# Altium project BA-77GHz-Radar_Frontend.PrjPcb (part 2 of 2)

## Sheet PLL_ADF4169.SchDoc
size A3; SheetNumber: 13; SheetTotal: 25
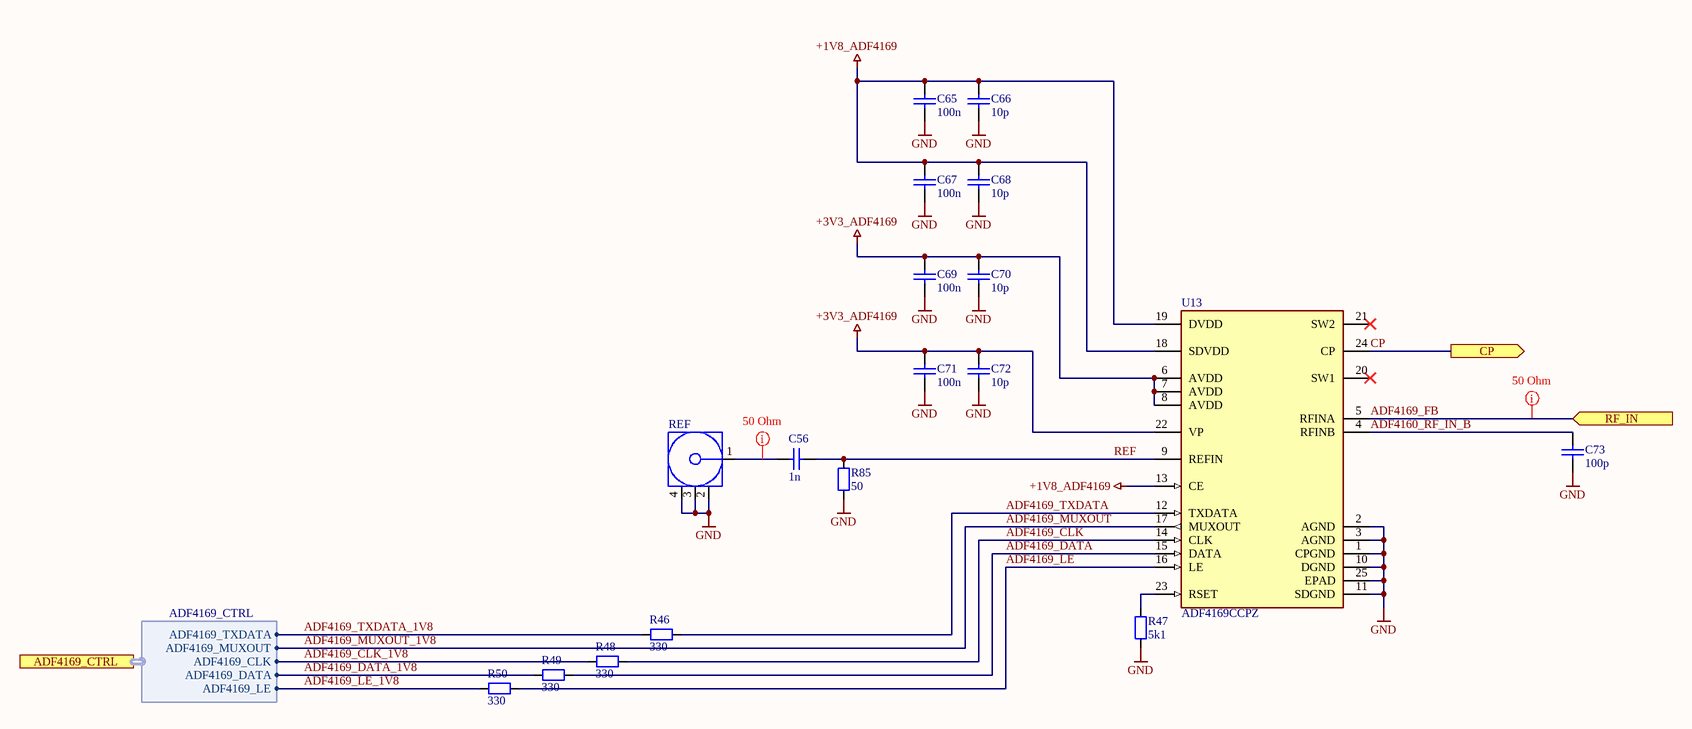
[diagram p13: PLL_ADF4169.SchDoc]

### Parts
C56  1n  [C_0402_1005Metric_IPC_N]
C65  100n  [C_0402_1005Metric_IPC_N]
C66  10p  [C_0402_1005Metric_IPC_N]
C67  100n  [C_0402_1005Metric_IPC_N]
C68  10p  [C_0402_1005Metric_IPC_N]
C69  100n  [C_0402_1005Metric_IPC_N]
C70  10p  [C_0402_1005Metric_IPC_N]
C71  100n  [C_0402_1005Metric_IPC_N]
C72  10p  [C_0402_1005Metric_IPC_N]
C73  100p  [C_0402_1005Metric_IPC_N]
R46  330  [R_0402_1005Metric_IPC_N]
R47  5k1  [R_0402_1005Metric_IPC_N]
R48  330  [R_0402_1005Metric_IPC_N]
R49  330  [R_0402_1005Metric_IPC_N]
R50  330  [R_0402_1005Metric_IPC_N]
R85  50  [R_0402_1005Metric_IPC_N]
REF  60312862112552  [60312862112552]  (value not drawn)
U13  ADF4169CCPZ  [LFCSP-WQ-24-1EP_4x4mm_P0.5mm_EP2.1x2.1mm_IPC_N]

### Ports
ADF4169_CTRL (harness ADF4169_CTRL, see Top_Level[2B], MCU[8A]), CP (out, see Top_Level[2B], Loop_Filter_AD8065[2C]), RF_IN (in, see Top_Level[2B])

### Harnesses
ADF4169_CTRL: ADF4169_MUXOUT, ADF4169_CLK, ADF4169_DATA, ADF4169_LE, ADF4169_TXDATA

### Nets
+1V8_ADF4169: C65.2 C66.2 C67.2 C68.2 U13.13(CE) U13.18(SDVDD) U13.19(DVDD)
+3V3_ADF4169: C69.2 C70.2 C71.2 C72.2 U13.6(AVDD) U13.7(AVDD) U13.8(AVDD) U13.22(VP)
GND: C65.1 C66.1 C67.1 C68.1 C69.1 C70.1 C71.1 C72.1 C73.1 R47.1 R85.1 REF.2(GND) REF.3(GND) REF.4(GND) U13.1(CPGND) U13.2(AGND) U13.3(AGND) U13.10(DGND) U13.11(SDGND) U13.25(EPAD)
ADF4160_RF_IN_B: C73.2 U13.4(RFINB)
ADF4169_CLK: R48.2 U13.14(CLK)
ADF4169_CLK_1V8: R48.1 ; port ADF4169_CTRL.ADF4169_CLK
ADF4169_DATA: R49.2 U13.15(DATA)
ADF4169_DATA_1V8: R49.1 ; port ADF4169_CTRL.ADF4169_DATA  [project net ADF4169_CTRL.ADF4169_DATA]
ADF4169_FB: U13.5(RFINA) ; port RF_IN
ADF4169_LE: R50.2 U13.16(LE)
ADF4169_LE_1V8: R50.1 ; port ADF4169_CTRL.ADF4169_LE  [project net ADF4169_CTRL.ADF4169_LE]
ADF4169_MUXOUT: U13.17(MUXOUT) ; port ADF4169_CTRL.ADF4169_MUXOUT  [also labelled ADF4169_MUXOUT_1V8]  [project net ADF4169_CTRL.ADF4169_MUXOUT]
ADF4169_TXDATA: R46.2 U13.12(TXDATA)
ADF4169_TXDATA_1V8: R46.1 ; port ADF4169_CTRL.ADF4169_TXDATA  [project net ADF4169_CTRL.ADF4169_TXDATA]
CP: U13.24(CP) ; port CP
REF: C56.1 R85.2 U13.9(REFIN)
NetC56_2: C56.2 REF.1(Signal)
NetR47_2: R47.2 U13.23(RSET)

Not connected (* = marked no-connect by the designer): U13 20(SW1)* 21(SW2)*

### Layout directives
net class 50R: ADF4169_FB
net class 50Ohm_CPWG: NetC56_2

### Library data of the parts
C56 = C000002: Generic MLCC with 0402 Footprint; Specific Component: False; Tolerance: 5%; Temp Coefficient: C0G; Voltage Rated: 50V; ID: C000002; Capacitance: 1n; min Temperature: *; max Temperature: *; Case: 0402; Supplier 1: Mouser; Supplier Part Number 1: 81-GRM1555C1H102JA1D; Supplier 2: Digikey; Supplier Part Number 2: 490-3244-1-ND
C65 C67 C69 C71 = C000002: Generic MLCC with 0402 Footprint; Specific Component: False; Tolerance: 10%; Temp Coefficient: X7R; Voltage Rated: 50V; ID: C000002; Capacitance: 100n; min Temperature: *; max Temperature: *; Case: 0402; Supplier 1: Mouser; Supplier Part Number 1: 81-GRM155R71H104KE4D; Supplier 2: Digikey; Supplier Part Number 2: 490-10700-1-ND
C66 C68 C70 C72 = C000002: Generic MLCC with 0402 Footprint; Specific Component: False; Tolerance: 0.5p; Temp Coefficient: C0G; Voltage Rated: 50V; ID: C000002; Capacitance: 10p; min Temperature: *; max Temperature: *; Case: 0402; Supplier 1: Mouser; Supplier Part Number 1: 187-CL05C100DB5NNNC; Supplier 2: Digikey; Supplier Part Number 2: 1276-1625-1-ND
C73 = C000002: as C23 on sheet TPS61377_16V; ID: C000002; Capacitance: 100p; Tolerance: *; Temp Coefficient: *; Voltage Rated: *; min Temperature: *; max Temperature: *; Case: 0402
R46 R48-R50 R85 = R000002: as R12 on sheet TPS61377_16V; ID: R000002; Tolerance: *; Power Rating: *; Composition: *; min Temperature: *; max Temperature: *; Temp Coefficient: *; Case: 0402
  R46 R48-R50: Resistance: 330
  R85: Resistance: 50
R47 = R000002: Generic Chip Resistor with 0402 Footprint; Specific Component: False; Tolerance: 1%; ID: R000002; Resistance: 5k1; Power Rating: *; Composition: *; min Temperature: *; max Temperature: *; Temp Coefficient: *; Case: 0402
REF = X000012: WR-SMA Connector, PCB Solderless, DC~18GHz, 50Ohm; Manufacturer: Würth; Center Contact Diameter: 0.25mm; Connector Type: SMA; Gender: Jack; Interface Type: MIL-STD-348; Manufacturer Part Number: 60312862112552; Category: Coaxial Connectors; Match Code: WR-SMA; ComponentLink1Description: Datasheet; ComponentLink1URL: https://www.we-online.com/components/products/datasheet/60312862112552.pdf; ComponentLink2Description: Datasheet Link; ComponentLink2URL: https://www.we-online.com/redexpert/spec/60312862112552?ad; Mount: Screw; Operating Temperature Max: 165°C; Operating Temperature Min: -65°C; Packaging: Tray; Frequency Range: DC~18GHz; Impedance: 50Ohm; Orientation: Right Angle; ID: X000012; Type: SMA Solderless Würth; Part Value: 60312862112552
U13 = CLK000004: Manufacturer: Analog Devices; ID: CLK000004; Type: PLL; Manufacturer Part Number: ADF4169CCPZ; Part Value: ADF4169CCPZ; Case: 24-LFCSP-WQ (4x4); ComponentLink1Description: Datasheet; ComponentLink1URL: https://www.analog.com/media/en/technical-documentation/data-sheets/ADF4169.pdf; Supplier 1: Mouser; Supplier Part Number 1: 584-ADF4169CCPZ; Supplier 2: Digikey; Supplier Part Number 2: 505-ADF4169CCPZ-ND

## Sheet Prescaler_HMC862A.SchDoc
size A4; SheetNumber: 17; SheetTotal: 26
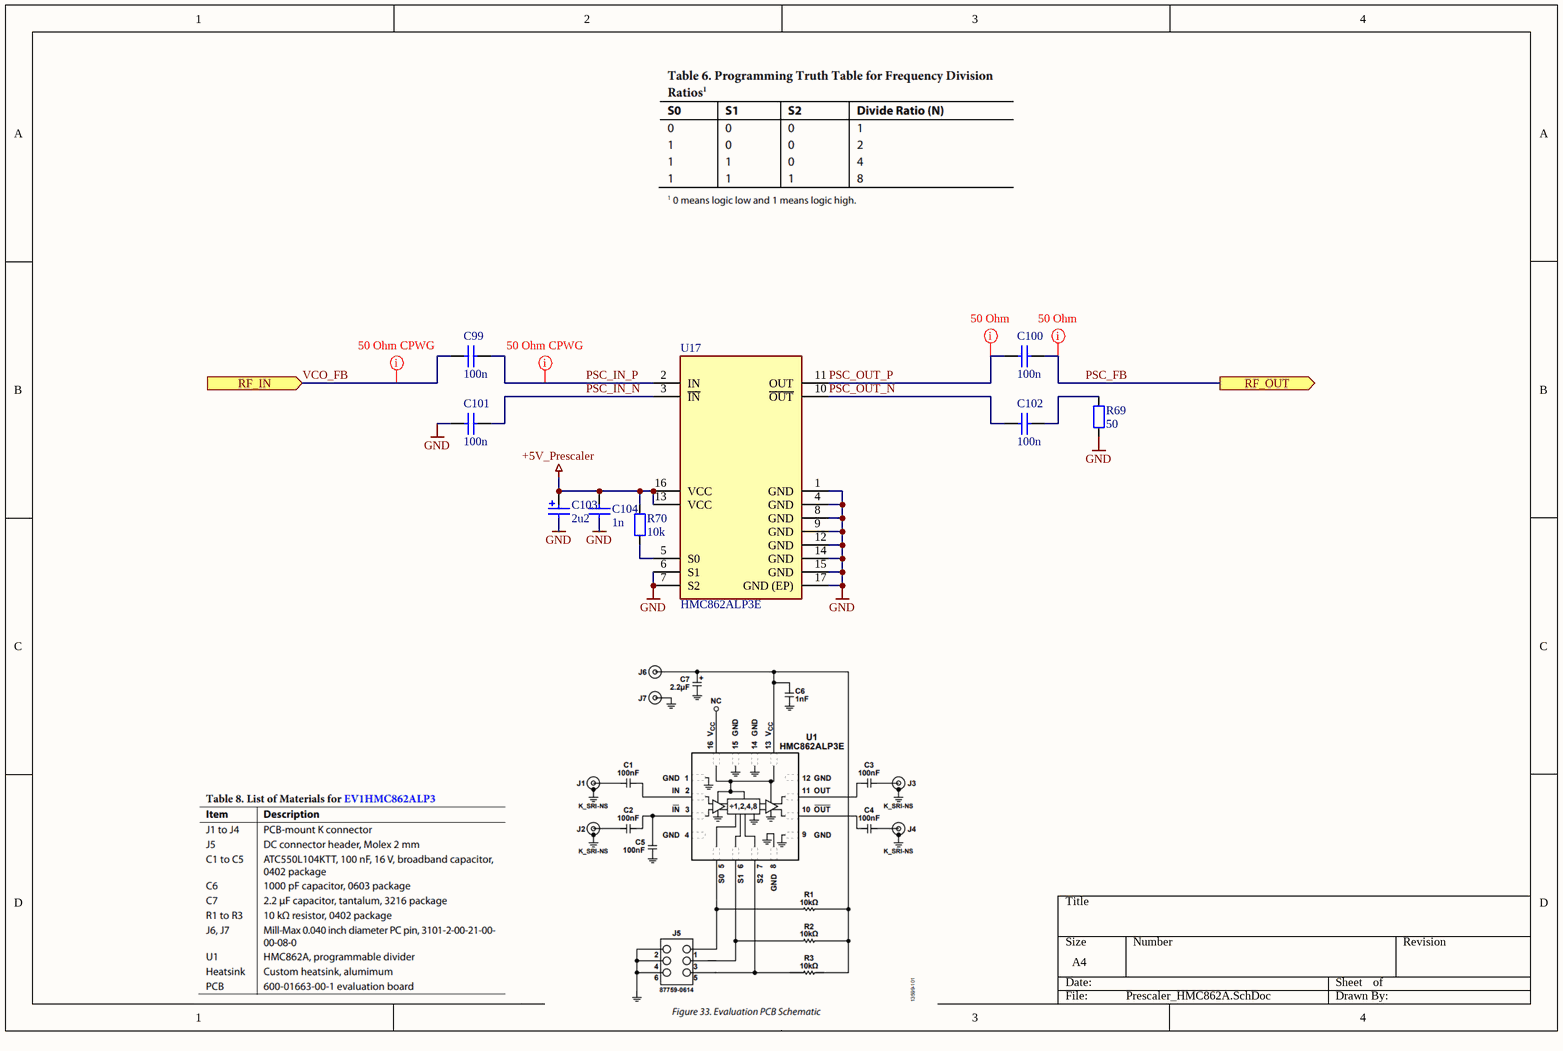
[diagram p14: Prescaler_HMC862A.SchDoc]

### Parts
C99  100n  [C_0402_1005Metric_IPC_N]
C100  100n  [C_0402_1005Metric_IPC_N]
C101  100n  [C_0402_1005Metric_IPC_N]
C102  100n  [C_0402_1005Metric_IPC_N]
C103  2u2  [C_1206_3216Metric_Pol_IPC_N]
C104  1n  [C_0603_1608Metric_IPC_N]
R69  50  [R_0402_1005Metric_IPC_N]
R70  10k  [R_0402_1005Metric_IPC_N]
U17  HMC862ALP3E  [LFCSP-16-1EP_3x3mm_P0.5mm_EP1.7x1.7mm_IPC_N]

### Ports
RF_IN (in, see Top_Level[3C]), RF_OUT (out, see Top_Level[2C])

### Nets
+5V_Prescaler: C103.1 C104.2 R70.1 U17.13(VCC) U17.16(VCC)
GND: C101.2 C103.2 C104.1 R69.1 U17.1(GND) U17.4(GND) U17.6(S1) U17.7(S2) U17.8(GND) U17.9(GND) U17.12(GND) U17.14(GND) U17.15(GND) U17.17(GND_(EP))
PSC_FB: C100.2 ; port RF_OUT
PSC_IN_N: C101.1 U17.3(~{IN})
PSC_IN_P: C99.1 U17.2(IN)
PSC_OUT_N: C102.1 U17.10(~{OUT})
PSC_OUT_P: C100.1 U17.11(OUT)
VCO_FB: C99.2 ; port RF_IN
NetC102_2: C102.2 R69.2
NetR70_2: R70.2 U17.5(S0)

### Layout directives
net class 50R: PSC_FB, PSC_OUT_P
net class 50Ohm_CPWG: PSC_IN_P, VCO_FB

### Library data of the parts
C99-C102 = C000002: as C23 on sheet TPS61377_16V; ID: C000002; Capacitance: 100n; Tolerance: *; Temp Coefficient: *; Voltage Rated: *; min Temperature: *; max Temperature: *; Case: 0402
C103 = C000008: Generic MLCC with 1206 Footprint; Specific Component: False; ID: C000008; Capacitance: 2u2; Tolerance: *; Temp Coefficient: *; Voltage Rated: *; min Temperature: *; max Temperature: *; Case: 1206
C104 = C000003: Generic MLCC with 0603 Footprint; Specific Component: False; ID: C000003; Capacitance: 1n; Tolerance: *; Temp Coefficient: *; Voltage Rated: *; min Temperature: *; max Temperature: *; Case: 0603
R69 R70 = R000002: as R12 on sheet TPS61377_16V; ID: R000002; Tolerance: *; Power Rating: *; Composition: *; min Temperature: *; max Temperature: *; Temp Coefficient: *; Case: 0402
  R69: Resistance: 50
  R70: Resistance: 10k
U17 = RF000011: Prescaler 5V Divide By 1/2/4/8 24000MHz 16-Pin LFCSP EP Cut Tape; Manufacturer_Name: Analog Devices; Geometry.Height: 0.9mm; Mouser Part Number: 584-HMC862ALP3E; Mouser Price/Stock: https://www.mouser.co.uk/ProductDetail/Analog-Devices/HMC862ALP3E?qs=JeIcUl65ClBGwj3wYTXQsA%3D%3D; Manufacturer_Part_Number: HMC862ALP3E; Datasheet Link: https://www.mouser.jp/datasheet/2/609/hmc862a-1504252.pdf; ID: RF000011; Type: Prescaler; Manufacturer Part Number: HMC862ALP3E; Manufacturer: Analog Devices; Part Value: HMC862ALP3E; Case: 16-LFCSP (3x3); ComponentLink1Description: Datasheet; ComponentLink1URL: https://www.analog.com/media/en/technical-documentation/data-sheets/hmc862a.pdf; Supplier 1: Mouser; Supplier Part Number 1: 584-HMC862ALP3E; Supplier 2: Digikey; Supplier Part Number 2: 505-HMC862ALP3E-ND

## Sheet Loop_Filter_AD8065.SchDoc
size A4; SheetNumber: 14; SheetTotal: 27
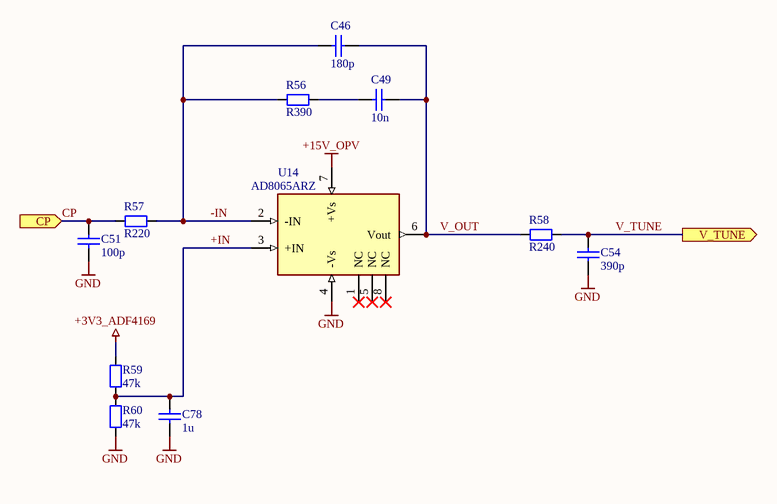
[diagram p15: Loop_Filter_AD8065.SchDoc]

### Parts
C46  180p  [C_0603_1608Metric_IPC_N]
C49  10n  [C_0603_1608Metric_IPC_N]
C51  100p  [C_0603_1608Metric_IPC_N]
C54  390p  [C_0603_1608Metric_IPC_N]
C78  1u  [C_0603_1608Metric_IPC_N]
R56  R390  [R_0603_1608Metric_IPC_N]
R57  R220  [R_0603_1608Metric_IPC_N]
R58  R240  [R_0603_1608Metric_IPC_N]
R59  47k  [R_0603_1608Metric_IPC_N]
R60  47k  [R_0603_1608Metric_IPC_N]
U14  AD8065ARZ  [SOIC-8_3.9x4.9mm_P1.27mm_IPC_N]

### Ports
CP (in, see Top_Level[2B], PLL_ADF4169[6B]), V_TUNE (out, see Top_Level[3B])

### Nets
+3V3_ADF4169: R59.2
+15V_OPV: U14.7(+Vs)
GND: C51.2 C54.1 C78.1 R60.1 U14.4(-Vs)
+IN: C78.2 R59.1 R60.2 U14.3(+IN)
-IN: C46.2 R56.2 R57.1 U14.2(-IN)
CP: C51.1 R57.2 ; port CP
V_OUT: C46.1 C49.1 R58.2 U14.6(Vout)
V_TUNE: C54.2 R58.1 ; port V_TUNE
NetC49_2: C49.2 R56.1

Not connected (* = marked no-connect by the designer): U14 1(NC)* 5(NC)* 8(NC)*

### Library data of the parts
C46 C49 C51 C54 C78 = C000003: as C104 on sheet Prescaler_HMC862A; ID: C000003; Tolerance: *; Temp Coefficient: *; Voltage Rated: *; min Temperature: *; max Temperature: *; Case: 0603
  C46: Capacitance: 180p
  C49: Capacitance: 10n
  C51: Capacitance: 100p
  C54: Capacitance: 390p
  C78: Capacitance: 1u
R56-R60 = R000003: Generic Chip Resistor with 0603 Footprint; Specific Component: False; ID: R000003; Tolerance: *; Power Rating: *; Composition: *; min Temperature: *; max Temperature: *; Temp Coefficient: *; Case: 0603
  R56: Resistance: R390
  R57: Resistance: R220
  R58: Resistance: R240
  R59 R60: Resistance: 47k
U14 = AMP000003: Manufacturer: Analog Devices; ID: AMP000003; Type: FastFET Op Amps; Manufacturer Part Number: AD8065ARZ; Part Value: AD8065ARZ; Case: SOIC-8; ComponentLink1Description: Datasheet; ComponentLink1URL: https://www.analog.com/media/en/technical-documentation/data-sheets/ad8065_8066.pdf; Supplier 1: Mouser; Supplier Part Number 1: 584-AD8065ARZ; Supplier 2: Digikey; Supplier Part Number 2: 505-AD8065ARZ-ND

## Sheet VCO_HMC8364.SchDoc
size A3; SheetNumber: 15; SheetTotal: 26
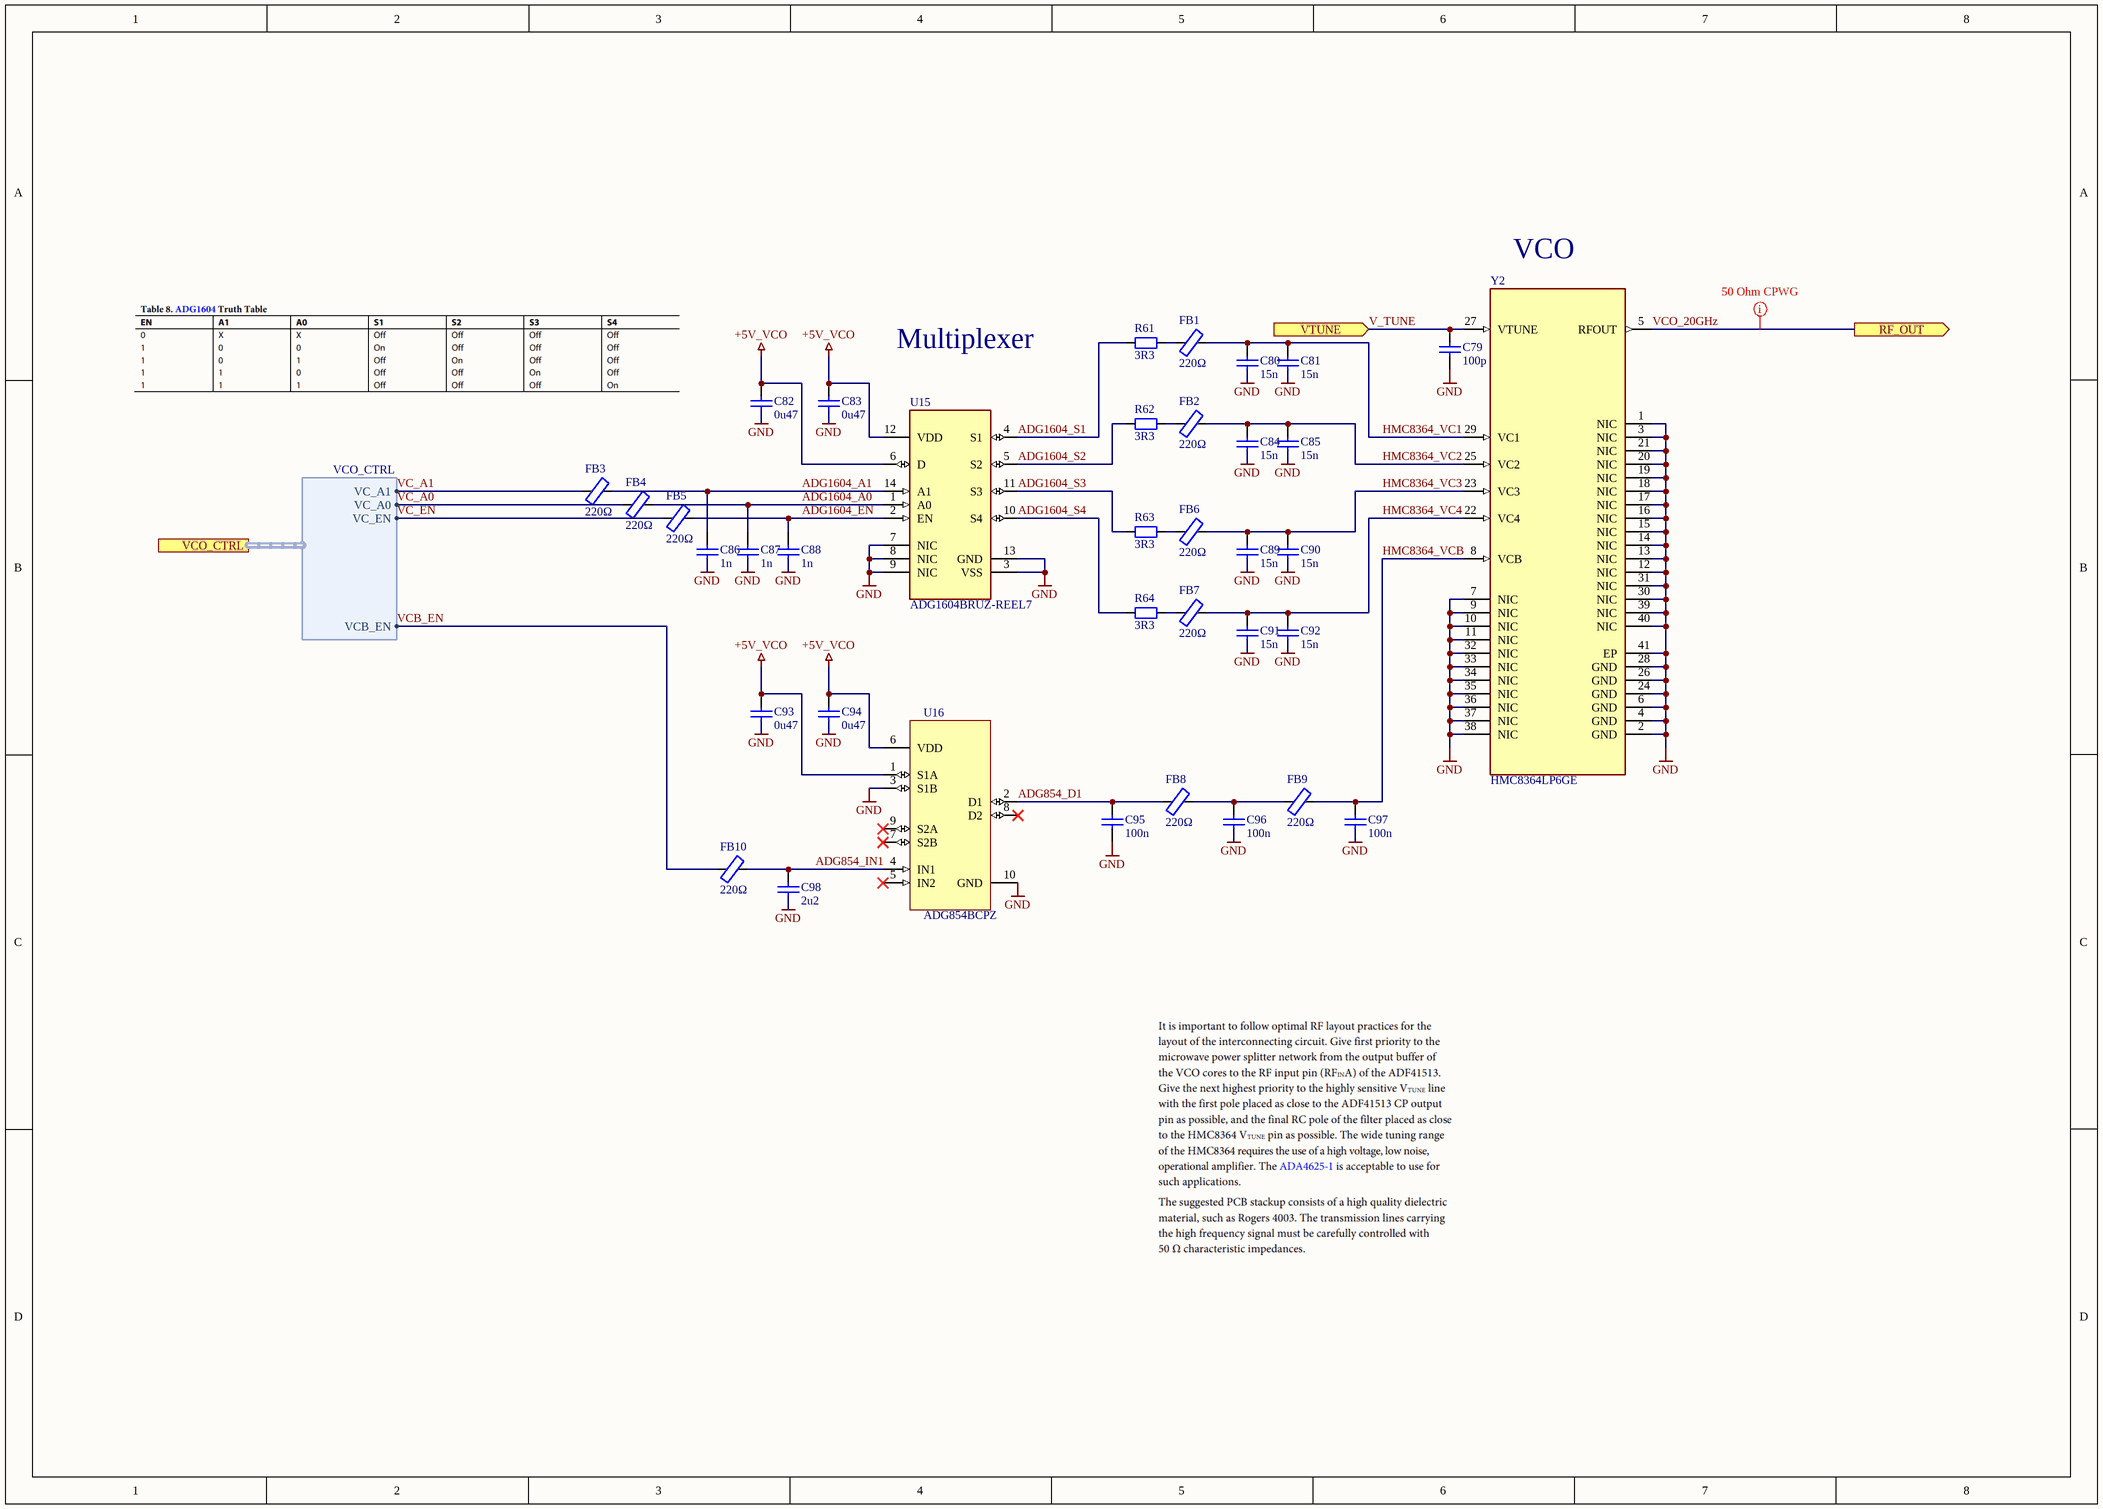
[diagram p16: VCO_HMC8364.SchDoc]

### Parts
C79  100p  [C_0402_1005Metric_IPC_N]
C80  15n  [C_0402_1005Metric_IPC_N]
C81  15n  [C_0402_1005Metric_IPC_N]
C82  0u47  [C_0402_1005Metric_IPC_N]
C83  0u47  [C_0402_1005Metric_IPC_N]
C84  15n  [C_0402_1005Metric_IPC_N]
C85  15n  [C_0402_1005Metric_IPC_N]
C86  1n  [C_0402_1005Metric_IPC_N]
C87  1n  [C_0402_1005Metric_IPC_N]
C88  1n  [C_0402_1005Metric_IPC_N]
C89  15n  [C_0402_1005Metric_IPC_N]
C90  15n  [C_0402_1005Metric_IPC_N]
C91  15n  [C_0402_1005Metric_IPC_N]
C92  15n  [C_0402_1005Metric_IPC_N]
C93  0u47  [C_0402_1005Metric_IPC_N]
C94  0u47  [C_0402_1005Metric_IPC_N]
C95  100n  [C_0402_1005Metric_IPC_N]
C96  100n  [C_0402_1005Metric_IPC_N]
C97  100n  [C_0402_1005Metric_IPC_N]
C98  2u2  [C_0402_1005Metric_IPC_N]
FB1  220Ω  [L_0402_1005Metric_IPC_N]
FB2  220Ω  [L_0402_1005Metric_IPC_N]
FB3  220Ω  [L_0402_1005Metric_IPC_N]
FB4  220Ω  [L_0402_1005Metric_IPC_N]
FB5  220Ω  [L_0402_1005Metric_IPC_N]
FB6  220Ω  [L_0402_1005Metric_IPC_N]
FB7  220Ω  [L_0402_1005Metric_IPC_N]
FB8  220Ω  [L_0402_1005Metric_IPC_N]
FB9  220Ω  [L_0402_1005Metric_IPC_N]
FB10  220Ω  [L_0402_1005Metric_IPC_N]
R61  3R3  [R_0402_1005Metric_IPC_N]
R62  3R3  [R_0402_1005Metric_IPC_N]
R63  3R3  [R_0402_1005Metric_IPC_N]
R64  3R3  [R_0402_1005Metric_IPC_N]
U15  ADG1604BRUZ-REEL7  [TSSOP65P640X120-14N]
U16  ADG854BCPZ  [LFCSP_UQ-10-1EP_1.3x1.6mm_P0.4mm_IPC_N]
Y2  HMC8364LP6GE  [LFCSP-40-1EP_6x6mm_P0.5mm_EP4.7x4.7mm_IPC_N]

### Ports
RF_OUT (out, see Top_Level[4B]), VCO_CTRL (harness VCO_CTRL, see Top_Level[3B], MCU[5C]), VTUNE (in, see Top_Level[3B])

### Harnesses
VCO_CTRL: VC_A1, VC_A0, VC_EN, VCB_EN

### Nets
+5V_VCO: C82.2 C83.2 C93.2 C94.2 U15.6(D) U15.12(VDD) U16.1(S1A) U16.6(VDD)
GND: C79.1 C80.1 C81.1 C82.1 C83.1 C84.1 C85.1 C86.1 C87.1 C88.1 C89.1 C90.1 C91.1 C92.1 C93.1 C94.1 C95.1 C96.1 C97.1 C98.1 U15.3(VSS) U15.7(NIC) U15.8(NIC) U15.9(NIC) U15.13(GND) U16.3(S1B) U16.10(GND) Y2.1(NIC) Y2.2(GND) Y2.3(NIC) Y2.4(GND) Y2.6(GND) Y2.7(NIC) Y2.9(NIC) Y2.10(NIC) Y2.11(NIC) Y2.12(NIC) Y2.13(NIC) Y2.14(NIC) Y2.15(NIC) Y2.16(NIC) Y2.17(NIC) Y2.18(NIC) Y2.19(NIC) Y2.20(NIC) Y2.21(NIC) Y2.24(GND) Y2.26(GND) Y2.28(GND) Y2.30(NIC) Y2.31(NIC) Y2.32(NIC) Y2.33(NIC) Y2.34(NIC) Y2.35(NIC) Y2.36(NIC) Y2.37(NIC) Y2.38(NIC) Y2.39(NIC) Y2.40(NIC) Y2.41(EP)
ADG854_D1: C95.2 FB8.1 U16.2(D1)
ADG854_IN1: C98.2 FB10.2 U16.4(IN1)
ADG1604_A0: C87.2 FB4.2 U15.1(A0)
ADG1604_A1: C86.2 FB3.2 U15.14(A1)
ADG1604_EN: C88.2 FB5.2 U15.2(EN)
ADG1604_S1: R61.1 U15.4(S1)
ADG1604_S2: R62.1 U15.5(S2)
ADG1604_S3: R63.1 U15.11(S3)
ADG1604_S4: R64.1 U15.10(S4)
HMC8364_VC1: C80.2 C81.2 FB1.2 Y2.29(VC1)
HMC8364_VC2: C84.2 C85.2 FB2.2 Y2.25(VC2)
HMC8364_VC3: C89.2 C90.2 FB6.2 Y2.23(VC3)
HMC8364_VC4: C91.2 C92.2 FB7.2 Y2.22(VC4)
HMC8364_VCB: C97.2 FB9.2 Y2.8(VCB)
V_TUNE: C79.2 Y2.27(VTUNE) ; port VTUNE
VC_A0: FB4.1 ; port VCO_CTRL.VC_A0
VC_A1: FB3.1 ; port VCO_CTRL.VC_A1
VC_EN: FB5.1 ; port VCO_CTRL.VC_EN
VCB_EN: FB10.1 ; port VCO_CTRL.VCB_EN
VCO_20GHz: Y2.5(RFOUT) ; port RF_OUT
NetC96_2: C96.2 FB8.2 FB9.1
NetFB1_1: FB1.1 R61.2
NetFB2_1: FB2.1 R62.2
NetFB6_1: FB6.1 R63.2
NetFB7_1: FB7.1 R64.2

Not connected (* = marked no-connect by the designer): U16 5(IN2)* 7(S2B)* 8(D2)* 9(S2A)*

### Layout directives
net class 50Ohm_CPWG: VCO_20GHz

### Notes on the sheet
- VCO
- Multiplexer

### Library data of the parts
C79-C81 C84 C85 C89-C92 C98 = C000002: Generic MLCC with 0402 Footprint; Specific Component: False; Voltage Rated: 50V; ID: C000002; Tolerance: *; Temp Coefficient: *; min Temperature: *; max Temperature: *; Case: 0402
  C79: Capacitance: 100p
  C80 C81 C84 C85 C89-C92: Capacitance: 15n
  C98: Capacitance: 2u2
C82 C86-C88 C93 = C000002: as C23 on sheet TPS61377_16V; ID: C000002; Tolerance: *; Temp Coefficient: *; Voltage Rated: *; min Temperature: *; max Temperature: *; Case: 0402
  C82 C93: Capacitance: 0u47
  C86-C88: Capacitance: 1n
C83 C94-C97 = C000002: as C65 on sheet PLL_ADF4169; ID: C000002; min Temperature: *; max Temperature: *; Case: 0402; Supplier 1: Mouser; Supplier Part Number 1: 81-GRM155R71H104KE4D; Supplier 2: Digikey; Supplier Part Number 2: 490-10700-1-ND
  C83 C94: Capacitance: 0u47
  C95-C97: Capacitance: 100n
FB1-FB10 = L000016: Ferrite Beads, 220Ω, 0.3A, *, 700m, *, 0402; Manufacturer: Murata Electronics; Manufacturer Part Number: BLM15GG221SN1D; Specific Component: True; min Temperature: -55; max Temperature: +125; ID: L000016; Type: Ferrite Beads; Inductance: 220Ω; Tolerance: *; Current Rating: 0.3A; Current - Saturation: *; DC resistance: 700m; Q @ Freq: *; Frequency - Self Resonant: *; Case: 0402; ComponentLink1Description: Datasheet; ComponentLink1URL: https://www.mouser.de/datasheet/3/76/1/ENFA0029.pdf; Supplier 1: Digikey; Supplier Part Number 1: 490-5197-1-ND; Supplier 2: Mouser; Supplier Part Number 2: 81-BLM15GG221SN1D
R61-R64 = R000002: as R12 on sheet TPS61377_16V; ID: R000002; Resistance: 3R3; Tolerance: *; Power Rating: *; Composition: *; min Temperature: *; max Temperature: *; Temp Coefficient: *; Case: 0402
U15 = LG000020: Manufacturer: Analog Devices; ID: LG000020; Type: Multiplexer; Manufacturer Part Number: ADG1604BRUZ-REEL7; Part Value: ADG1604BRUZ-REEL7; Case: TSSOP-14; ComponentLink1Description: Datasheet; ComponentLink1URL: https://www.analog.com/media/en/technical-documentation/data-sheets/ADG1604.pdf; Supplier 1: Digikey; Supplier Part Number 1: ADG1604BRUZ-REEL7CT-ND; Supplier 2: Mouser; Supplier Part Number 2: 584-ADG1604BRUZ-R7
U16 = LG000021: Manufacturer: Analog Devices; ID: LG000021; Type: Multiplexer; Manufacturer Part Number: ADG854BCPZ; Part Value: ADG854BCPZ; Case: 20-LFCSP_UQ; ComponentLink1Description: Datasheet; ComponentLink1URL: https://www.analog.com/media/en/technical-documentation/data-sheets/ADG854.pdf; Supplier 1: Digikey; Supplier Part Number 1: 505-ADG854BCPZ-REEL7CT-ND; Supplier 2: Mouser; Supplier Part Number 2: 584-ADG854BCPZ-R7
Y2 = Y000004: VCO Oscillators Custom DRT Quad Band VCO 18.2- 26.5 GHz; Manufacturer_Name: Analog Devices; Manufacturer_Part_Number: HMC862ALP3E; Geometry.Height: 0.9mm; Mouser Part Number: 584-HMC862ALP3E; Mouser Price/Stock: https://www.mouser.co.uk/ProductDetail/Analog-Devices/HMC862ALP3E?qs=JeIcUl65ClBGwj3wYTXQsA%3D%3D; Datasheet Link: https://www.mouser.jp/datasheet/2/609/hmc862a-1504252.pdf; ID: Y000004; Type: VCO; Manufacturer Part Number: HMC8364LP6GE; Manufacturer: Analog Devices; Part Value: HMC8364LP6GE; Case: 40-LFCSP (6x6); ComponentLink1Description: Datasheet; ComponentLink1URL: https://www.analog.com/media/en/technical-documentation/data-sheets/hmc8364.pdf; Supplier 1: Digikey; Supplier Part Number 1: 505-HMC8364LP6GE-ND; Supplier 2: Mouser; Supplier Part Number 2: 584-HMC8364LP6GE

## Sheet TX_RUBVERANO.SchDoc
size A3; SheetNumber: 21; SheetTotal: 25
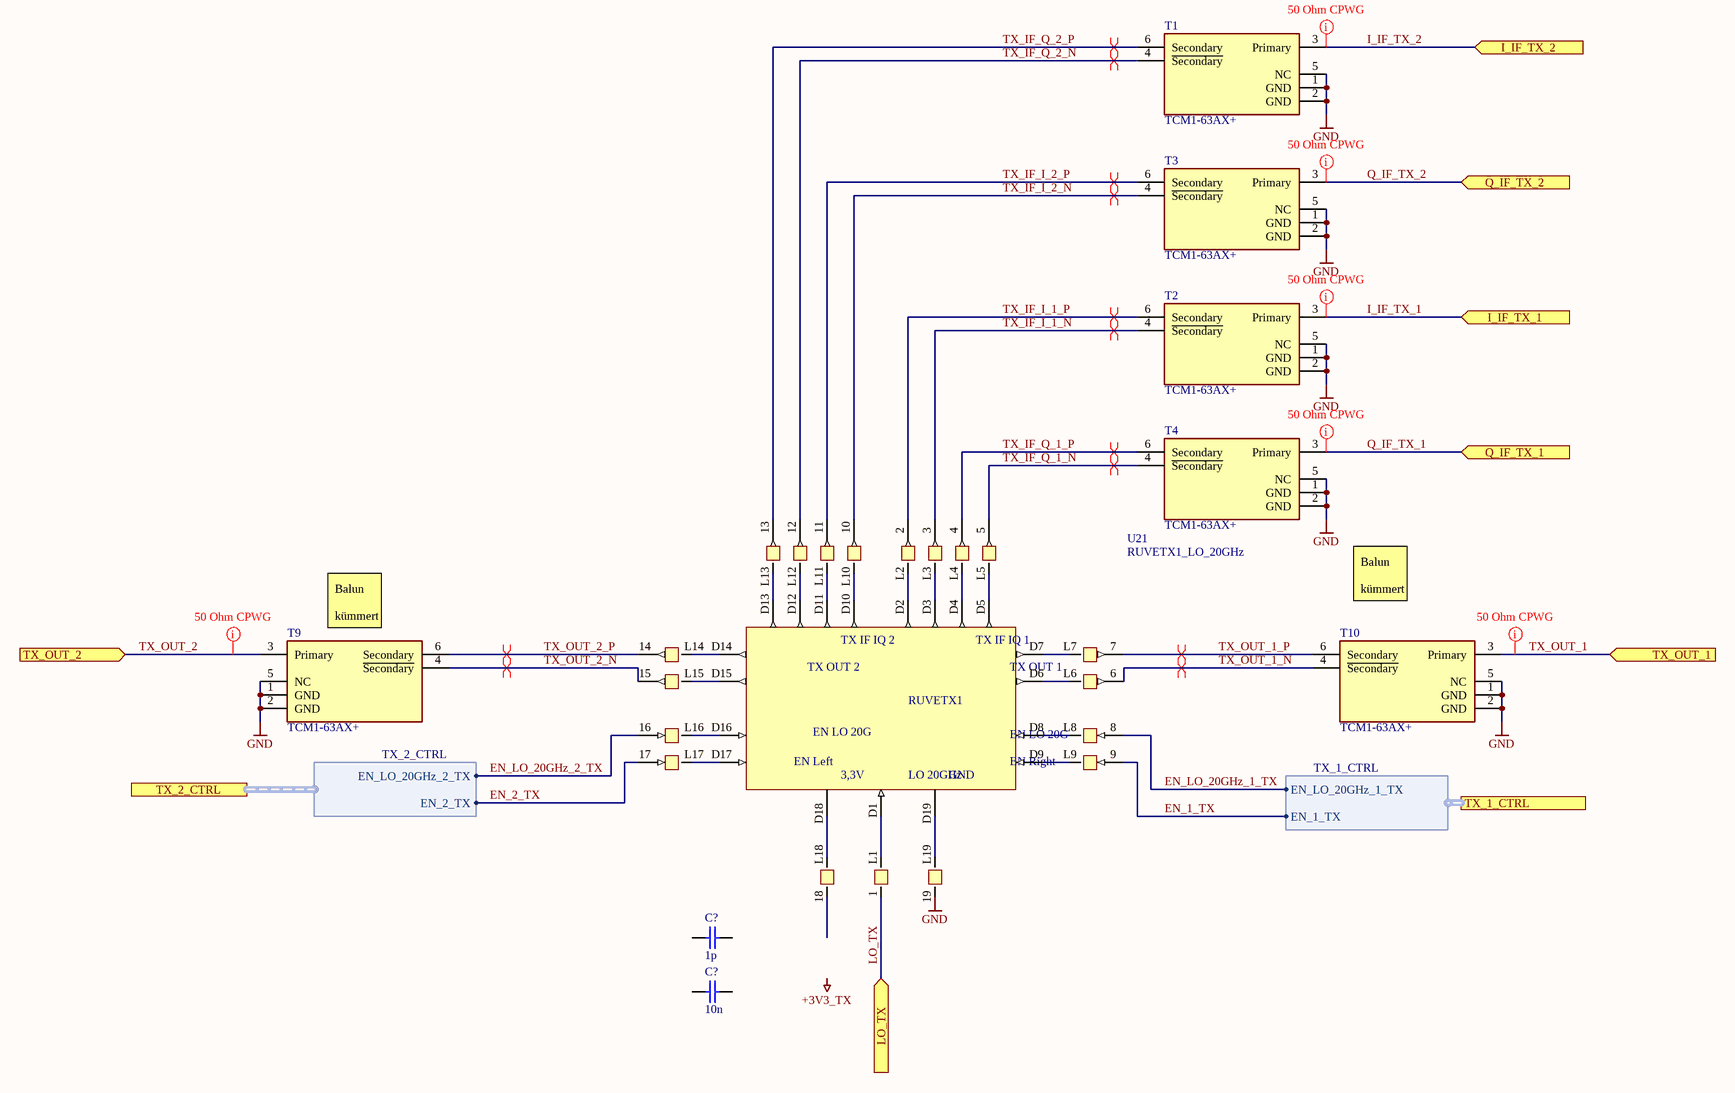
[diagram p17: TX_RUBVERANO.SchDoc]

### Parts
(Parts that share a designator on the sheet are numbered #1, #2 ... from top to bottom, then left to right.)
C?#1  1p  [C_0402_1005Metric_IPC_N]
C?#2  10n  [C_0402_1005Metric_IPC_N]
T1  TCM1-63AX+  [DB1627]
T2  TCM1-63AX+  [DB1627]
T3  TCM1-63AX+  [DB1627]
T4  TCM1-63AX+  [DB1627]
T9  TCM1-63AX+  [DB1627]
T10  TCM1-63AX+  [DB1627]
U21  RUVETX1_LO_20GHz  [RUVETX1_LO_20GHz]

### Ports
I_IF_TX_1 (in, see Top_Level[7B], IF_Connectors[2C]), I_IF_TX_2 (in, see Top_Level[7B], IF_Connectors[2C]), LO_TX (in, see Top_Level[6B]), Q_IF_TX_1 (in, see Top_Level[7B], IF_Connectors[2C]), Q_IF_TX_2 (in, see Top_Level[7B], IF_Connectors[2C]), TX_1_CTRL (harness TX_1_CTRL, see Top_Level[6B], MCU[5C]), TX_2_CTRL (harness TX_2_CTRL, see Top_Level[6B], MCU[5C]), TX_OUT_1 (in, see Top_Level[7B], GSG_TX[2B]), TX_OUT_2 (in, see Top_Level[7B], GSG_TX[2B])

### Harnesses
TX_2_CTRL: EN_2_TX, EN_LO_20GHz_2_TX
TX_1_CTRL: EN_1_TX, EN_LO_20GHz_1_TX

### Nets
GND: T1.1(GND) T1.2(GND) T1.5(NC) T2.1(GND) T2.2(GND) T2.5(NC) T3.1(GND) T3.2(GND) T3.5(NC) T4.1(GND) T4.2(GND) T4.5(NC) T9.1(GND) T9.2(GND) T9.5(NC) T10.1(GND) T10.2(GND) T10.5(NC) U21.19
EN_1_TX: U21.9 ; port TX_1_CTRL.EN_1_TX
EN_2_TX: U21.17 ; port TX_2_CTRL.EN_2_TX
EN_LO_20GHz_1_TX: U21.8 ; port TX_1_CTRL.EN_LO_20GHz_1_TX
EN_LO_20GHz_2_TX: U21.16 ; port TX_2_CTRL.EN_LO_20GHz_2_TX
I_IF_TX_1: T2.3(Primary) ; port I_IF_TX_1
I_IF_TX_2: T1.3(Primary) ; port I_IF_TX_2
LO_TX: U21.1 ; port LO_TX
Q_IF_TX_1: T4.3(Primary) ; port Q_IF_TX_1
Q_IF_TX_2: T3.3(Primary) ; port Q_IF_TX_2
TX_IF_I_1_N: T2.4(~{Secondary}) U21.3
TX_IF_I_1_P: T2.6(Secondary) U21.2
TX_IF_I_2_N: T3.4(~{Secondary}) U21.10
TX_IF_I_2_P: T3.6(Secondary) U21.11
TX_IF_Q_1_N: T4.4(~{Secondary}) U21.5
TX_IF_Q_1_P: T4.6(Secondary) U21.4
TX_IF_Q_2_N: T1.4(~{Secondary}) U21.12
TX_IF_Q_2_P: T1.6(Secondary) U21.13
TX_OUT_1: T10.3(Primary) ; port TX_OUT_1
TX_OUT_1_N: T10.4(~{Secondary}) U21.6
TX_OUT_1_P: T10.6(Secondary) U21.7
TX_OUT_2: T9.3(Primary) ; port TX_OUT_2
TX_OUT_2_N: T9.4(~{Secondary}) U21.15
TX_OUT_2_P: T9.6(Secondary) U21.14
NetU21_D1: U21.D1 U21.L1
NetU21_D2: U21.D2 U21.L2
NetU21_D3: U21.D3 U21.L3
NetU21_D4: U21.D4 U21.L4
NetU21_D5: U21.D5 U21.L5
NetU21_D6: U21.D6 U21.L6
NetU21_D7: U21.D7 U21.L7
NetU21_D8: U21.D8 U21.L8
NetU21_D9: U21.D9 U21.L9
NetU21_D10: U21.D10 U21.L10
NetU21_D11: U21.D11 U21.L11
NetU21_D12: U21.D12 U21.L12
NetU21_D13: U21.D13 U21.L13
NetU21_D14: U21.D14 U21.L14
NetU21_D15: U21.D15 U21.L15
NetU21_D16: U21.D16 U21.L16
NetU21_D17: U21.D17 U21.L17
NetU21_D18: U21.D18 U21.L18
NetU21_D19: U21.D19 U21.L19

Not connected (* = marked no-connect by the designer): C?#1 1 2; C?#2 1 2; U21 18

### Layout directives
differential pair: TX_IF_I_1_N, TX_IF_I_1_P, TX_IF_I_2_N, TX_IF_I_2_P, TX_IF_Q_1_N, TX_IF_Q_1_P, TX_IF_Q_2_N, TX_IF_Q_2_P, TX_OUT_1_N, TX_OUT_1_P, TX_OUT_2_N, TX_OUT_2_P
net class 50Ohm_CPWG: I_IF_TX_1, I_IF_TX_2, Q_IF_TX_1, Q_IF_TX_2, TX_OUT_1, TX_OUT_2

### Notes on the sheet
- Balun
  kümmert sich Tobi drum
- (near T9) Balun
  kümmert sich Tobi drum
- Labels drawn without touching a wire or pin: +3V3_TX
- (in symbol RF000012) TX IF IQ 2; TX IF IQ 1; TX OUT 2; TX OUT 1; RUVETX1; EN LO 20G; EN Left; EN Right; 3,3V; LO 20GHz; GND

### Library data of the parts
C?#1 C?#2 = C000002: as C23 on sheet TPS61377_16V; ID: C000002; Tolerance: *; Temp Coefficient: *; Voltage Rated: *; min Temperature: *; max Temperature: *; Case: 0402
  C?#1: Capacitance: 1p
  C?#2: Capacitance: 10n
T1-T4 T9 T10 = RF000014: Manufacturer: Minicircuits; Type: Balun; ID: RF000014; Manufacturer Part Number: TCM1-63AX+; Part Value: TCM1-63AX+; Case: DB1627; ComponentLink1Description: Datasheet; ComponentLink1URL: https://www.minicircuits.com/pdfs/TCM1-63AX+.pdf; Supplier 1: Mouser; Supplier Part Number 1: 139-TCM1-63AX; Supplier 2: Digikey; Supplier Part Number 2: 3157-TCM1-63AX+CT-ND
U21 = RF000012: RUVETX1 LO-Eingang bei 20 GHz; Manufacturer: RUB; ID: RF000012; Type: Radar Transmitter; Manufacturer Part Number: RUVETX1_LO_20GHz; Part Value: RUVETX1_LO_20GHz; Case: custom

## Sheet RX_RUBVERANO.SchDoc
size A3; SheetNumber: 22; SheetTotal: 25
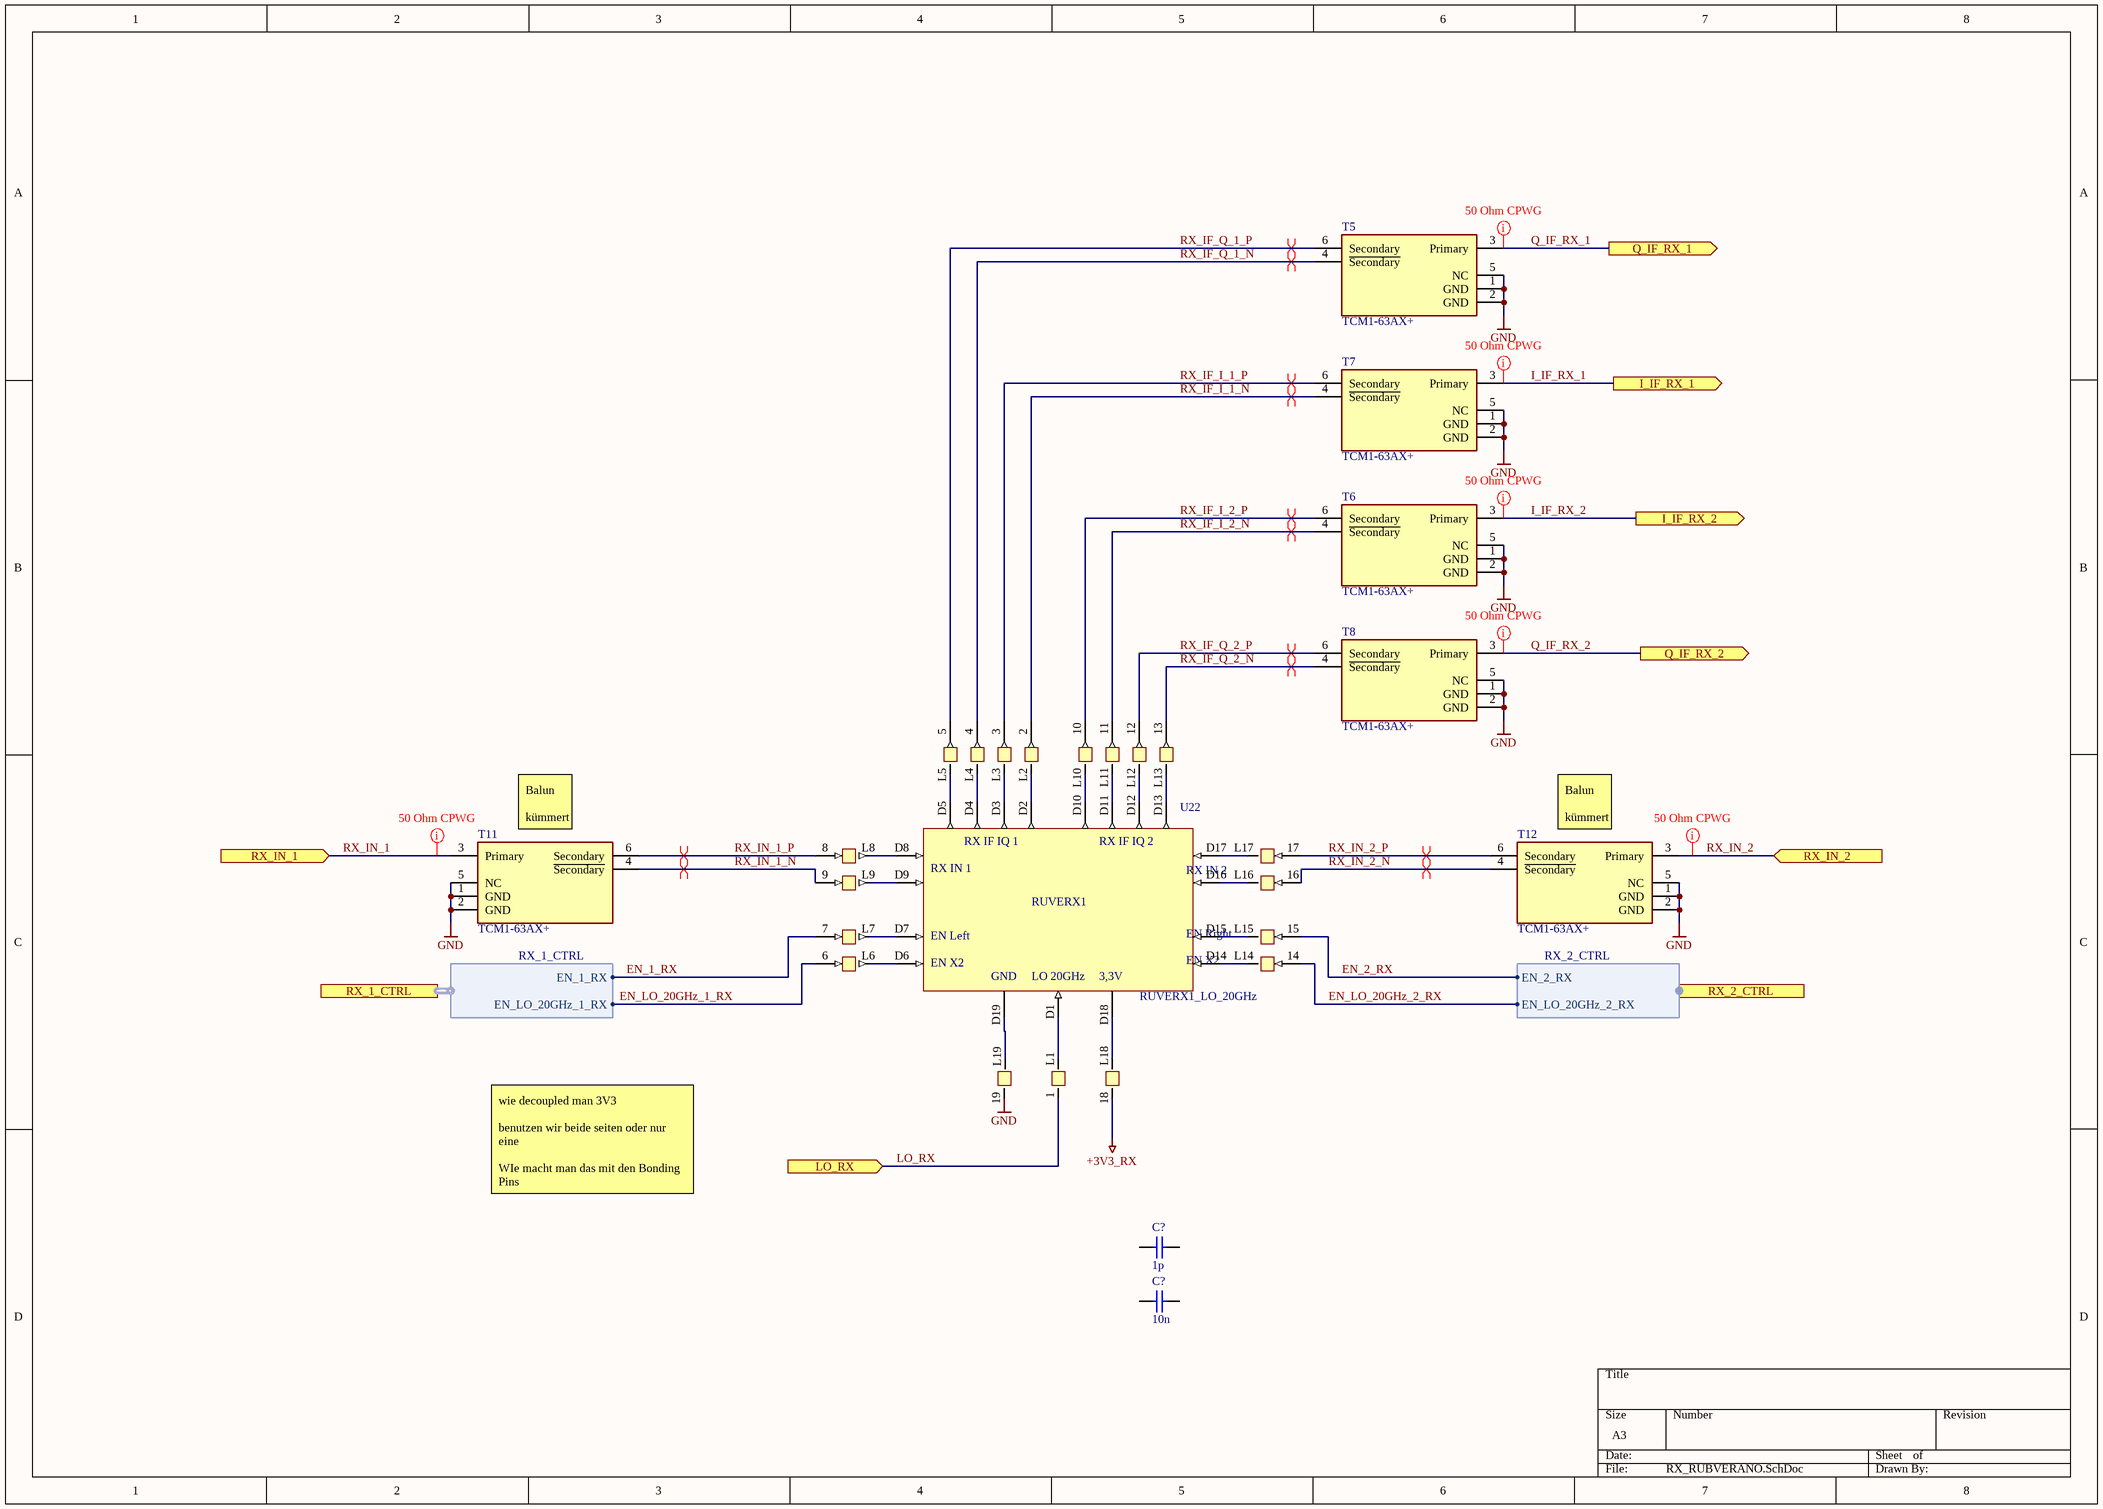
[diagram p18: RX_RUBVERANO.SchDoc]

### Parts
(Parts that share a designator on the sheet are numbered #1, #2 ... from top to bottom, then left to right.)
C?#3  1p  [C_0402_1005Metric_IPC_N]
C?#4  10n  [C_0402_1005Metric_IPC_N]
T5  TCM1-63AX+  [DB1627]
T6  TCM1-63AX+  [DB1627]
T7  TCM1-63AX+  [DB1627]
T8  TCM1-63AX+  [DB1627]
T11  TCM1-63AX+  [DB1627]
T12  TCM1-63AX+  [DB1627]
U22  RUVERX1_LO_20GHz  [RUVERX1_LO_20GHz]

### Ports
I_IF_RX_1 (out, see Top_Level[7B], IF_Connectors[2A]), I_IF_RX_2 (out, see Top_Level[7B], IF_Connectors[2A]), LO_RX (in, see Top_Level[6B]), Q_IF_RX_1 (out, see Top_Level[7B], IF_Connectors[2B]), Q_IF_RX_2 (out, see Top_Level[7C], IF_Connectors[2B]), RX_1_CTRL (harness RX_1_CTRL, see Top_Level[6C], MCU[5C]), RX_2_CTRL (harness RX_2_CTRL, see Top_Level[6C], MCU[5C]), RX_IN_1 (in, see Top_Level[7C], GSG_RX[2B]), RX_IN_2 (in, see Top_Level[7C], GSG_RX[2B])

### Harnesses
RX_2_CTRL: EN_LO_20GHz_2_RX, EN_2_RX
RX_1_CTRL: EN_LO_20GHz_1_RX, EN_1_RX

### Nets
+3V3_RX: U22.18
GND: T5.1(GND) T5.2(GND) T5.5(NC) T6.1(GND) T6.2(GND) T6.5(NC) T7.1(GND) T7.2(GND) T7.5(NC) T8.1(GND) T8.2(GND) T8.5(NC) T11.1(GND) T11.2(GND) T11.5(NC) T12.1(GND) T12.2(GND) T12.5(NC) U22.19
EN_1_RX: U22.7 ; port RX_1_CTRL.EN_1_RX
EN_2_RX: U22.15 ; port RX_2_CTRL.EN_2_RX
EN_LO_20GHz_1_RX: U22.6 ; port RX_1_CTRL.EN_LO_20GHz_1_RX
EN_LO_20GHz_2_RX: U22.14 ; port RX_2_CTRL.EN_LO_20GHz_2_RX
I_IF_RX_1: T7.3(Primary) ; port I_IF_RX_1
I_IF_RX_2: T6.3(Primary) ; port I_IF_RX_2
LO_RX: U22.1 ; port LO_RX
Q_IF_RX_1: T5.3(Primary) ; port Q_IF_RX_1
Q_IF_RX_2: T8.3(Primary) ; port Q_IF_RX_2
RX_IF_I_1_N: T7.4(~{Secondary}) U22.2
RX_IF_I_1_P: T7.6(Secondary) U22.3
RX_IF_I_2_N: T6.4(~{Secondary}) U22.11
RX_IF_I_2_P: T6.6(Secondary) U22.10
RX_IF_Q_1_N: T5.4(~{Secondary}) U22.4
RX_IF_Q_1_P: T5.6(Secondary) U22.5
RX_IF_Q_2_N: T8.4(~{Secondary}) U22.13
RX_IF_Q_2_P: T8.6(Secondary) U22.12
RX_IN_1: T11.3(Primary) ; port RX_IN_1
RX_IN_1_N: T11.4(~{Secondary}) U22.9
RX_IN_1_P: T11.6(Secondary) U22.8
RX_IN_2: T12.3(Primary) ; port RX_IN_2
RX_IN_2_N: T12.4(~{Secondary}) U22.16
RX_IN_2_P: T12.6(Secondary) U22.17
NetU22_D1: U22.D1 U22.L1
NetU22_D2: U22.D2 U22.L2
NetU22_D3: U22.D3 U22.L3
NetU22_D4: U22.D4 U22.L4
NetU22_D5: U22.D5 U22.L5
NetU22_D6: U22.D6 U22.L6
NetU22_D7: U22.D7 U22.L7
NetU22_D8: U22.D8 U22.L8
NetU22_D9: U22.D9 U22.L9
NetU22_D10: U22.D10 U22.L10
NetU22_D11: U22.D11 U22.L11
NetU22_D12: U22.D12 U22.L12
NetU22_D13: U22.D13 U22.L13
NetU22_D14: U22.D14 U22.L14
NetU22_D15: U22.D15 U22.L15
NetU22_D16: U22.D16 U22.L16
NetU22_D17: U22.D17 U22.L17
NetU22_D18: U22.D18 U22.L18
NetU22_D19: U22.D19 U22.L19

Not connected (* = marked no-connect by the designer): C?#3 1 2; C?#4 1 2

### Layout directives
differential pair: RX_IF_I_1_N, RX_IF_I_1_P, RX_IF_I_2_N, RX_IF_I_2_P, RX_IF_Q_1_N, RX_IF_Q_1_P, RX_IF_Q_2_N, RX_IF_Q_2_P, RX_IN_1_N, RX_IN_1_P, RX_IN_2_N, RX_IN_2_P
net class 50Ohm_CPWG: I_IF_RX_1, I_IF_RX_2, Q_IF_RX_1, Q_IF_RX_2, RX_IN_1, RX_IN_2

### Notes on the sheet
- (near T11) Balun
  kümmert sich Tobi drum
- (near T12) Balun
  kümmert sich Tobi drum
- wie decoupled man 3V3
  benutzen wir beide seiten oder nur eine
  WIe macht man das mit den Bonding Pins
- (in symbol RF000013) RX IF IQ 1; RX IF IQ 2; RX IN 1; RX IN 2; RUVERX1; EN Left; EN Right; EN X2; GND; LO 20GHz; 3,3V

### Library data of the parts
C?#3 C?#4 = C000002: as C23 on sheet TPS61377_16V; ID: C000002; Tolerance: *; Temp Coefficient: *; Voltage Rated: *; min Temperature: *; max Temperature: *; Case: 0402
  C?#3: Capacitance: 1p
  C?#4: Capacitance: 10n
T5-T8 T11 T12 = RF000014: Manufacturer: Minicircuits; Type: Balun; ID: RF000014; Manufacturer Part Number: TCM1-63AX+; Part Value: TCM1-63AX+; Case: DB1627; ComponentLink1Description: Datasheet; ComponentLink1URL: https://www.minicircuits.com/pdfs/TCM1-63AX+.pdf; Supplier 1: Mouser; Supplier Part Number 1: 139-TCM1-63AX; Supplier 2: Digikey; Supplier Part Number 2: 3157-TCM1-63AX+CT-ND
U22 = RF000013: RUVETX1 LO-Eingang bei 20 GHz; Manufacturer: RUB; ID: RF000013; Type: Radar Receiver; Manufacturer Part Number: RUVERX1_LO_20GHz; Part Value: RUVERX1_LO_20GHz; Case: custom

## Sheet 3dB_Attenuator.SchDoc
size A4; SheetNumber: 20; SheetTotal: 26
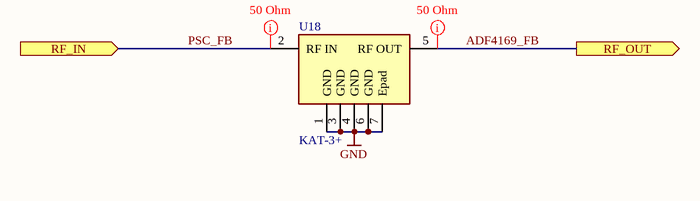
[diagram p19: 3dB_Attenuator.SchDoc]

### Parts
U18  KAT-3+  [MC1630-1]

### Ports
RF_IN (in, see Top_Level[2C]), RF_OUT (out, see Top_Level[2C])

### Nets
GND: U18.1(GND) U18.3(GND) U18.4(GND) U18.6(GND) U18.7(Epad)
ADF4169_FB: U18.5(RF_OUT) ; port RF_OUT
PSC_FB: U18.2(RF_IN) ; port RF_IN

### Layout directives
net class 50R: ADF4169_FB, PSC_FB

### Library data of the parts
U18 = RF000015: Manufacturer: Minicircuits; ID: RF000015; Type: Attenuator; Manufacturer Part Number: KAT-3+; Part Value: KAT-3+; Case: MC1630-1; ComponentLink1Description: Datasheet; ComponentLink1URL: https://www.minicircuits.com/pdfs/KAT-3+.pdf; Supplier 1: Mouser; Supplier Part Number 1: 139-KAT-3+; Supplier 2: Digikey; Supplier Part Number 2: 3157-KAT-3+CT-ND

## Sheet WPD_PLL.SchDoc
size A4; SheetNumber: 16; SheetTotal: 26
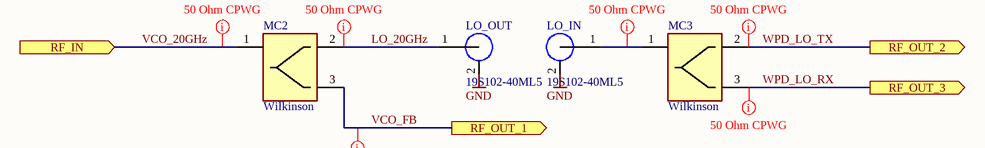
[diagram p20: WPD_PLL.SchDoc]

### Parts
LO_IN  19S102-40ML5  [Rosenberger_19S102-40ML5]
LO_OUT  19S102-40ML5  [Rosenberger_19S102-40ML5]
MC2  Wilkinson  [Wilkinson_8GHz_RO4350B_254um]  (net tie, no BOM)
MC3  Wilkinson  [Wilkinson_8GHz_RO4350B_254um]  (net tie, no BOM)

### Ports
RF_IN (in, see Top_Level[4B]), RF_OUT_1 (out, see Top_Level[4B]), RF_OUT_2 (out, see Top_Level[4B]), RF_OUT_3 (out, see Top_Level[4B])

### Nets
GND: LO_IN.2 LO_OUT.2
LO_20GHz: LO_OUT.1 MC2.2
VCO_20GHz: MC2.1 ; port RF_IN
VCO_FB: MC2.3 ; port RF_OUT_1
WPD_LO_RX: MC3.3 ; port RF_OUT_3
WPD_LO_TX: MC3.2 ; port RF_OUT_2
NetLO_IN_1: LO_IN.1 MC3.1

### Layout directives
net class 50Ohm_CPWG: LO_20GHz, NetLO_IN_1, VCO_20GHz, VCO_FB, WPD_LO_RX, WPD_LO_TX

### Library data of the parts
LO_IN LO_OUT = X000008: Manufacturer: Rosenberger; ID: X000008; Type: SMP Coax PCB Vertical Mount; Manufacturer Part Number: 19S102-40ML5; Part Value: 19S102-40ML5; ComponentLink1Description: Datasheet; ComponentLink1URL: https://products.rosenberger.com/_ocassets/db/19S102-40ML5.pdf; Supplier 1: Mouser; Supplier Part Number 1: 476-19S102-40ML5; Supplier 2: Digikey; Supplier Part Number 2: 476-19S102-40ML5
MC2 MC3 = LG000001: Substrate Type: RO4350B; Substrate Height: 254um; Design Frequency: 8GHz; ID: LG000001; Type: Wilkinson

## Sheet 20dB_Attenuator_RX.SchDoc
size A4; SheetNumber: 19; SheetTotal: 26
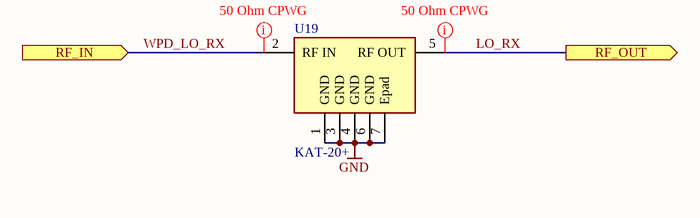
[diagram p21: 20dB_Attenuator_RX.SchDoc]

### Parts
U19  KAT-20+  [MC1630-1]

### Ports
RF_IN (in, see Top_Level[5B]), RF_OUT (out, see Top_Level[6B])

### Nets
GND: U19.1(GND) U19.3(GND) U19.4(GND) U19.6(GND) U19.7(Epad)
LO_RX: U19.5(RF_OUT) ; port RF_OUT
WPD_LO_RX: U19.2(RF_IN) ; port RF_IN

### Layout directives
net class 50Ohm_CPWG: LO_RX, WPD_LO_RX

### Library data of the parts
U19 = RF000016: Manufacturer: Minicircuits; ID: RF000016; Type: Attenuator; Manufacturer Part Number: KAT-20+; Part Value: KAT-20+; Case: MC1630-1; ComponentLink1Description: Datasheet; ComponentLink1URL: https://www.minicircuits.com/pdfs/KAT-20+.pdf; Supplier 1: Mouser; Supplier Part Number 1: 139-KAT-20+; Supplier 2: Digikey; Supplier Part Number 2: 3157-KAT-20+CT-ND

## Sheet 20dB_Attenuator_TX.SchDoc
size A4; SheetNumber: 20; SheetTotal: 26
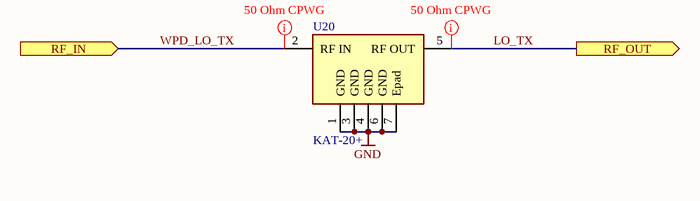
[diagram p22: 20dB_Attenuator_TX.SchDoc]

### Parts
U20  KAT-20+  [MC1630-1]

### Ports
RF_IN (in, see Top_Level[5B]), RF_OUT (out, see Top_Level[6B])

### Nets
GND: U20.1(GND) U20.3(GND) U20.4(GND) U20.6(GND) U20.7(Epad)
LO_TX: U20.5(RF_OUT) ; port RF_OUT
WPD_LO_TX: U20.2(RF_IN) ; port RF_IN

### Layout directives
net class 50Ohm_CPWG: LO_TX, WPD_LO_TX

### Library data of the parts
U20 = RF000016: Manufacturer: Minicircuits; ID: RF000016; Type: Attenuator; Manufacturer Part Number: KAT-20+; Part Value: KAT-20+; Case: MC1630-1; ComponentLink1Description: Datasheet; ComponentLink1URL: https://www.minicircuits.com/pdfs/KAT-20+.pdf; Supplier 1: Mouser; Supplier Part Number 1: 139-KAT-20+; Supplier 2: Digikey; Supplier Part Number 2: 3157-KAT-20+CT-ND

## Sheet GSG_RX.SchDoc
size A4; SheetNumber: 25; SheetTotal: 27
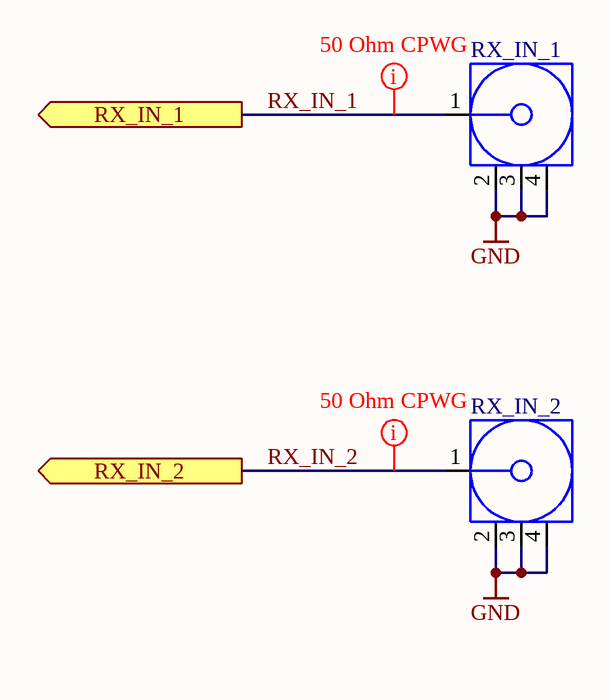
[diagram p23: GSG_RX.SchDoc]

### Parts
RX_IN_1  60312862112552  [60312862112552]  (value not drawn)
RX_IN_2  60312862112552  [60312862112552]  (value not drawn)

### Ports
RX_IN_1 (out, see Top_Level[7C], RX_RUBVERANO[1C]), RX_IN_2 (out, see Top_Level[7C], RX_RUBVERANO[7C])

### Nets
GND: RX_IN_1.2(GND) RX_IN_1.3(GND) RX_IN_1.4(GND) RX_IN_2.2(GND) RX_IN_2.3(GND) RX_IN_2.4(GND)
RX_IN_1: RX_IN_1.1(Signal) ; port RX_IN_1
RX_IN_2: RX_IN_2.1(Signal) ; port RX_IN_2

### Layout directives
net class 50Ohm_CPWG: RX_IN_1, RX_IN_2

### Library data of the parts
RX_IN_1 RX_IN_2 = X000012: WR-SMA Connector, PCB Solderless, DC~18GHz, 50Ohm; Manufacturer: Würth; Center Contact Diameter: 0.25mm; Connector Type: SMA; Gender: Jack; Interface Type: MIL-STD-348; Manufacturer Part Number: 60312862112552; Category: Coaxial Connectors; Match Code: WR-SMA; ComponentLink1Description: Datasheet; ComponentLink1URL: https://www.we-online.com/components/products/datasheet/60312862112552.pdf; ComponentLink2Description: Datasheet Link; ComponentLink2URL: https://www.we-online.com/redexpert/spec/60312862112552?ad; Mount: Screw; Operating Temperature Max: 165°C; Operating Temperature Min: -65°C; Packaging: Tray; Frequency Range: DC~18GHz; Impedance: 50Ohm; Orientation: Right Angle; ID: X000012; Type: SMA Solderless Würth; Part Value: 60312862112552

## Sheet GSG_TX.SchDoc
size A4; SheetNumber: 24; SheetTotal: 27
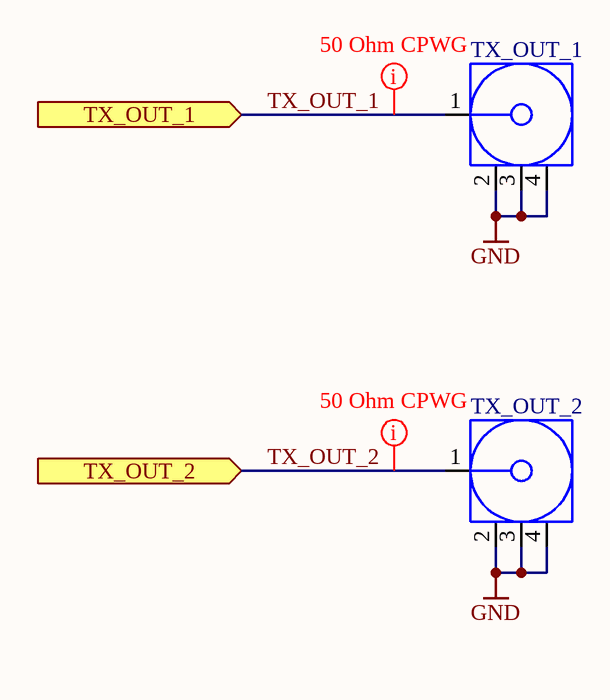
[diagram p24: GSG_TX.SchDoc]

### Parts
TX_OUT_1  60312862112552  [60312862112552]  (value not drawn)
TX_OUT_2  60312862112552  [60312862112552]  (value not drawn)

### Ports
TX_OUT_1 (in, see Top_Level[7B], TX_RUBVERANO[8C]), TX_OUT_2 (in, see Top_Level[7B], TX_RUBVERANO[1C])

### Nets
GND: TX_OUT_1.2(GND) TX_OUT_1.3(GND) TX_OUT_1.4(GND) TX_OUT_2.2(GND) TX_OUT_2.3(GND) TX_OUT_2.4(GND)
TX_OUT_1: TX_OUT_1.1(Signal) ; port TX_OUT_1
TX_OUT_2: TX_OUT_2.1(Signal) ; port TX_OUT_2

### Layout directives
net class 50Ohm_CPWG: TX_OUT_1, TX_OUT_2

### Library data of the parts
TX_OUT_1 TX_OUT_2 = X000012: as RX_IN_1 on sheet GSG_RX; Manufacturer Part Number: 60312862112552; Category: Coaxial Connectors; Match Code: WR-SMA; ComponentLink1Description: Datasheet; ComponentLink1URL: https://www.we-online.com/components/products/datasheet/60312862112552.pdf; ComponentLink2Description: Datasheet Link; ComponentLink2URL: https://www.we-online.com/redexpert/spec/60312862112552?ad; Mount: Screw; Operating Temperature Max: 165°C; Operating Temperature Min: -65°C; Packaging: Tray; Frequency Range: DC~18GHz; Impedance: 50Ohm; Orientation: Right Angle; ID: X000012; Type: SMA Solderless Würth; Part Value: 60312862112552

## Sheet IF_Connectors.SchDoc
size A4; SheetNumber: 23; SheetTotal: 26
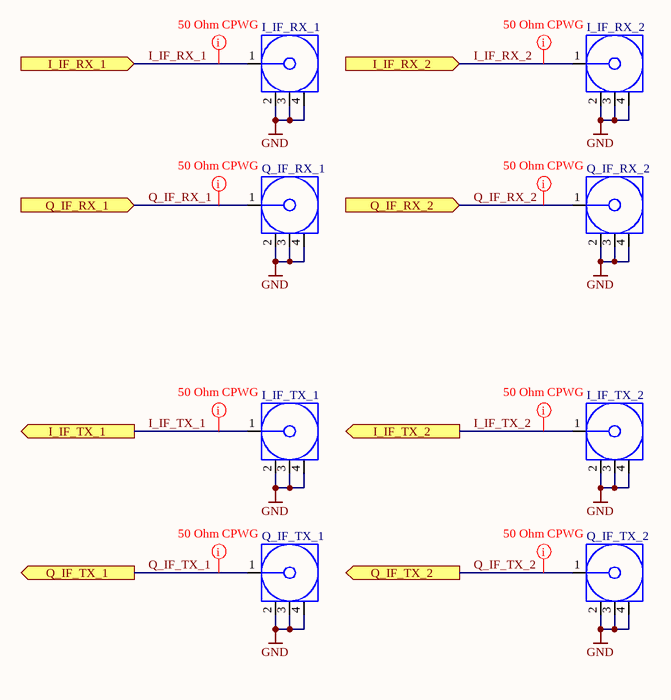
[diagram p25: IF_Connectors.SchDoc]

### Parts
I_IF_RX_1  60312862112552  [60312862112552]  (value not drawn)
I_IF_RX_2  60312862112552  [60312862112552]  (value not drawn)
I_IF_TX_1  60312862112552  [60312862112552]  (value not drawn)
I_IF_TX_2  60312862112552  [60312862112552]  (value not drawn)
Q_IF_RX_1  60312862112552  [60312862112552]  (value not drawn)
Q_IF_RX_2  60312862112552  [60312862112552]  (value not drawn)
Q_IF_TX_1  60312862112552  [60312862112552]  (value not drawn)
Q_IF_TX_2  60312862112552  [60312862112552]  (value not drawn)

### Ports
I_IF_RX_1 (in, see Top_Level[7B], RX_RUBVERANO[7B]), I_IF_RX_2 (in, see Top_Level[7B], RX_RUBVERANO[7B]), I_IF_TX_1 (out, see Top_Level[7B], TX_RUBVERANO[7B]), I_IF_TX_2 (out, see Top_Level[7B], TX_RUBVERANO[7B]), Q_IF_RX_1 (in, see Top_Level[7B], RX_RUBVERANO[7A]), Q_IF_RX_2 (in, see Top_Level[7C], RX_RUBVERANO[7B]), Q_IF_TX_1 (out, see Top_Level[7B], TX_RUBVERANO[7C]), Q_IF_TX_2 (out, see Top_Level[7B], TX_RUBVERANO[7B])

### Nets
GND: I_IF_RX_1.2(GND) I_IF_RX_1.3(GND) I_IF_RX_1.4(GND) I_IF_RX_2.2(GND) I_IF_RX_2.3(GND) I_IF_RX_2.4(GND) I_IF_TX_1.2(GND) I_IF_TX_1.3(GND) I_IF_TX_1.4(GND) I_IF_TX_2.2(GND) I_IF_TX_2.3(GND) I_IF_TX_2.4(GND) Q_IF_RX_1.2(GND) Q_IF_RX_1.3(GND) Q_IF_RX_1.4(GND) Q_IF_RX_2.2(GND) Q_IF_RX_2.3(GND) Q_IF_RX_2.4(GND) Q_IF_TX_1.2(GND) Q_IF_TX_1.3(GND) Q_IF_TX_1.4(GND) Q_IF_TX_2.2(GND) Q_IF_TX_2.3(GND) Q_IF_TX_2.4(GND)
I_IF_RX_1: I_IF_RX_1.1(Signal) ; port I_IF_RX_1
I_IF_RX_2: I_IF_RX_2.1(Signal) ; port I_IF_RX_2
I_IF_TX_1: I_IF_TX_1.1(Signal) ; port I_IF_TX_1
I_IF_TX_2: I_IF_TX_2.1(Signal) ; port I_IF_TX_2
Q_IF_RX_1: Q_IF_RX_1.1(Signal) ; port Q_IF_RX_1
Q_IF_RX_2: Q_IF_RX_2.1(Signal) ; port Q_IF_RX_2
Q_IF_TX_1: Q_IF_TX_1.1(Signal) ; port Q_IF_TX_1
Q_IF_TX_2: Q_IF_TX_2.1(Signal) ; port Q_IF_TX_2

### Layout directives
net class 50Ohm_CPWG: I_IF_RX_1, I_IF_RX_2, I_IF_TX_1, I_IF_TX_2, Q_IF_RX_1, Q_IF_RX_2, Q_IF_TX_1, Q_IF_TX_2

### Library data of the parts
I_IF_RX_1 I_IF_RX_2 I_IF_TX_1 I_IF_TX_2 Q_IF_RX_1 Q_IF_RX_2 Q_IF_TX_1 Q_IF_TX_2 = X000012: as RX_IN_1 on sheet GSG_RX; Manufacturer Part Number: 60312862112552; Category: Coaxial Connectors; Match Code: WR-SMA; ComponentLink1Description: Datasheet; ComponentLink1URL: https://www.we-online.com/components/products/datasheet/60312862112552.pdf; ComponentLink2Description: Datasheet Link; ComponentLink2URL: https://www.we-online.com/redexpert/spec/60312862112552?ad; Mount: Screw; Operating Temperature Max: 165°C; Operating Temperature Min: -65°C; Packaging: Tray; Frequency Range: DC~18GHz; Impedance: 50Ohm; Orientation: Right Angle; ID: X000012; Type: SMA Solderless Würth; Part Value: 60312862112552

## Nets that join several sheets
+1V8_ADF4169: XC6204_1V8 (C64.2 R84.1 U12.5), MCU (C11.2 C13.2 U2.14 U3.6), PLL_ADF4169 (7 pins)
+3V3_ADF4169: LT3042_3V3 (C53.2 R80.1 U9.9 U9.10), PLL_ADF4169 (8 pins), Loop_Filter_AD8065 (R59.2)
+3V3_RX: U_Power_Supply/LDO_RX_3V3 (C58_LDO_RX_3V3.2 R81_LDO_RX_3V3.1 U10_LDO_RX_3V3.9 U10_LDO_RX_3V3.10), RX_RUBVERANO (U22.18)
+3V3_STM32: TLV755P_3V3 (C62.2 R82.1 U11.5), MCU (24 pins)
+4V_BUCK: LT3042_3V3 (C52.2 U9.1 U9.2 U9.6), U_Power_Supply/LDO_TX_3V3 (C57_LDO_TX_3V3.2 U10_LDO_TX_3V3.1 U10_LDO_TX_3V3.2 U10_LDO_TX_3V3.6), XC6204_1V8 (C63.2 R83.2 U12.1), AP62500_4V (6 pins), TLV755P_3V3 (C61.2 U11.1 U11.3), U_Power_Supply/LDO_RX_3V3 (C57_LDO_RX_3V3.2 U10_LDO_RX_3V3.1 U10_LDO_RX_3V3.2 U10_LDO_RX_3V3.6)
+5V_Prescaler: U_Power_Supply/LDO_Prescaler_5V (C48_LDO_Prescaler_5V.2 R79_LDO_Prescaler_5V.1 U8_LDO_Prescaler_5V.9 U8_LDO_Prescaler_5V.10), Prescaler_HMC862A (5 pins)
+5V_VCO: U_Power_Supply/LDO_VCO_5V (C48_LDO_VCO_5V.2 R79_LDO_VCO_5V.1 U8_LDO_VCO_5V.9 U8_LDO_VCO_5V.10), VCO_HMC8364 (8 pins)
+6V_BUCK: U_Power_Supply/LDO_VCO_5V (C47_LDO_VCO_5V.2 U8_LDO_VCO_5V.1 U8_LDO_VCO_5V.2 U8_LDO_VCO_5V.6), U_Power_Supply/LDO_Prescaler_5V (C47_LDO_Prescaler_5V.2 U8_LDO_Prescaler_5V.1 U8_LDO_Prescaler_5V.2 U8_LDO_Prescaler_5V.6), AP62500_6V (6 pins)
+12V: Power_Supply (X1.1), TPS61377_16V (5 pins), AP62500_4V (C27.2 C28.2 R31.1 U5.2), AP62500_6V (C34.2 C35.2 U6.2)
+15V_OPV: LT3042_15V (C43.2 R78.1 U7.9 U7.10), Loop_Filter_AD8065 (U14.7)
+16V_BOOST: TPS61377_16V (7 pins), LT3042_15V (C42.2 U7.1 U7.2 U7.6)
GND: Power_Supply (X1.2 X1.MH1 X1.MH2), TPS61377_16V (14 pins), LT3042_15V (8 pins), U_Power_Supply/LDO_VCO_5V (8 pins), U_Power_Supply/LDO_Prescaler_5V (8 pins), LT3042_3V3 (8 pins), U_Power_Supply/LDO_TX_3V3 (8 pins), XC6204_1V8 (C63.1 C64.1 Q3.2 U12.2), AP62500_4V (12 pins), AP62500_6V (12 pins), TLV755P_3V3 (C61.1 C62.1 LED18.2 U11.2), U_Power_Supply/LDO_RX_3V3 (8 pins), MCU (57 pins), PLL_ADF4169 (20 pins), Prescaler_HMC862A (14 pins), Loop_Filter_AD8065 (5 pins), VCO_HMC8364 (61 pins), TX_RUBVERANO (19 pins), RX_RUBVERANO (19 pins), 3dB_Attenuator (5 pins), WPD_PLL (LO_IN.2 LO_OUT.2), 20dB_Attenuator_RX (5 pins), 20dB_Attenuator_TX (5 pins), GSG_RX (6 pins), GSG_TX (6 pins), IF_Connectors (24 pins)
ADF4169_CLK_1V8: MCU (U2.13), PLL_ADF4169 (R48.1)
ADF4169_CTRL.ADF4169_DATA: MCU (U2.12), PLL_ADF4169 (R49.1)
ADF4169_CTRL.ADF4169_LE: MCU (U2.11), PLL_ADF4169 (R50.1)
ADF4169_CTRL.ADF4169_MUXOUT: MCU (U2.10), PLL_ADF4169 (U13.17)
ADF4169_CTRL.ADF4169_TXDATA: MCU (U3.4), PLL_ADF4169 (R46.1)
ADF4169_FB: PLL_ADF4169 (U13.5), 3dB_Attenuator (U18.5)
AP62500_EN: AP62500_6V (U6.3), MCU (R19.2 U1.16)
CP: PLL_ADF4169 (U13.24), Loop_Filter_AD8065 (C51.1 R57.2)
EN_1_RX: MCU (R65.2 U1.24), RX_RUBVERANO (U22.7)
EN_1_TX: MCU (R52.2 U1.62), TX_RUBVERANO (U21.9)
EN_2_RX: MCU (R54.2 U1.27), RX_RUBVERANO (U22.15)
EN_2_TX: MCU (R22.2 U1.58), TX_RUBVERANO (U21.17)
EN_LO_20GHz_1_RX: MCU (R55.2 U1.25), RX_RUBVERANO (U22.6)
EN_LO_20GHz_1_TX: MCU (R51.2 U1.61), TX_RUBVERANO (U21.8)
EN_LO_20GHz_2_RX: MCU (R53.2 U1.26), RX_RUBVERANO (U22.14)
EN_LO_20GHz_2_TX: MCU (R21.2 U1.59), TX_RUBVERANO (U21.16)
I_IF_RX_1: RX_RUBVERANO (T7.3), IF_Connectors (I_IF_RX_1.1)
I_IF_RX_2: RX_RUBVERANO (T6.3), IF_Connectors (I_IF_RX_2.1)
I_IF_TX_1: TX_RUBVERANO (T2.3), IF_Connectors (I_IF_TX_1.1)
I_IF_TX_2: TX_RUBVERANO (T1.3), IF_Connectors (I_IF_TX_2.1)
LO_RX: RX_RUBVERANO (U22.1), 20dB_Attenuator_RX (U19.5)
LO_TX: TX_RUBVERANO (U21.1), 20dB_Attenuator_TX (U20.5)
LT3042_ADF4169_1V8_EN: XC6204_1V8 (U12.3), MCU (R9.2 U1.38)
LT3042_ADF4169_3V3_EN: LT3042_3V3 (U9.3), MCU (R13.2 U1.34)
LT3042_OPV_EN: LT3042_15V (U7.3), MCU (R18.2 U1.54)
LT3042_PSC_EN: U_Power_Supply/LDO_Prescaler_5V (U8_LDO_Prescaler_5V.3), MCU (R15.2 U1.33)
LT3042_VCO_EN: U_Power_Supply/LDO_VCO_5V (U8_LDO_VCO_5V.3), MCU (R17.2 U1.56)
LT3045_RX_EN: U_Power_Supply/LDO_RX_3V3 (U10_LDO_RX_3V3.3), MCU (R10.2 U1.28)
LT3045_TX_EN: U_Power_Supply/LDO_TX_3V3 (U10_LDO_TX_3V3.3), MCU (R11.2 U1.57)
PSC_FB: Prescaler_HMC862A (C100.2), 3dB_Attenuator (U18.2)
Q_IF_RX_1: RX_RUBVERANO (T5.3), IF_Connectors (Q_IF_RX_1.1)
Q_IF_RX_2: RX_RUBVERANO (T8.3), IF_Connectors (Q_IF_RX_2.1)
Q_IF_TX_1: TX_RUBVERANO (T4.3), IF_Connectors (Q_IF_TX_1.1)
Q_IF_TX_2: TX_RUBVERANO (T3.3), IF_Connectors (Q_IF_TX_2.1)
RX_IN_1: RX_RUBVERANO (T11.3), GSG_RX (RX_IN_1.1)
RX_IN_2: RX_RUBVERANO (T12.3), GSG_RX (RX_IN_2.1)
TPS61377_EN: TPS61377_16V (U4.2), MCU (R20.2 U1.15)
TX_OUT_1: TX_RUBVERANO (T10.3), GSG_TX (TX_OUT_1.1)
TX_OUT_2: TX_RUBVERANO (T9.3), GSG_TX (TX_OUT_2.1)
V_TUNE: Loop_Filter_AD8065 (C54.2 R58.1), VCO_HMC8364 (C79.2 Y2.27)
VC_A0: MCU (R7.2 U1.40), VCO_HMC8364 (FB4.1)
VC_A1: MCU (R8.2 U1.52), VCO_HMC8364 (FB3.1)
VC_EN: MCU (R6.2 U1.39), VCO_HMC8364 (FB5.1)
VCB_EN: MCU (R5.2 U1.53), VCO_HMC8364 (FB10.1)
VCO_20GHz: VCO_HMC8364 (Y2.5), WPD_PLL (MC2.1)
VCO_FB: Prescaler_HMC862A (C99.2), WPD_PLL (MC2.3)
WPD_LO_RX: WPD_PLL (MC3.3), 20dB_Attenuator_RX (U19.2)
WPD_LO_TX: WPD_PLL (MC3.2), 20dB_Attenuator_TX (U20.2)